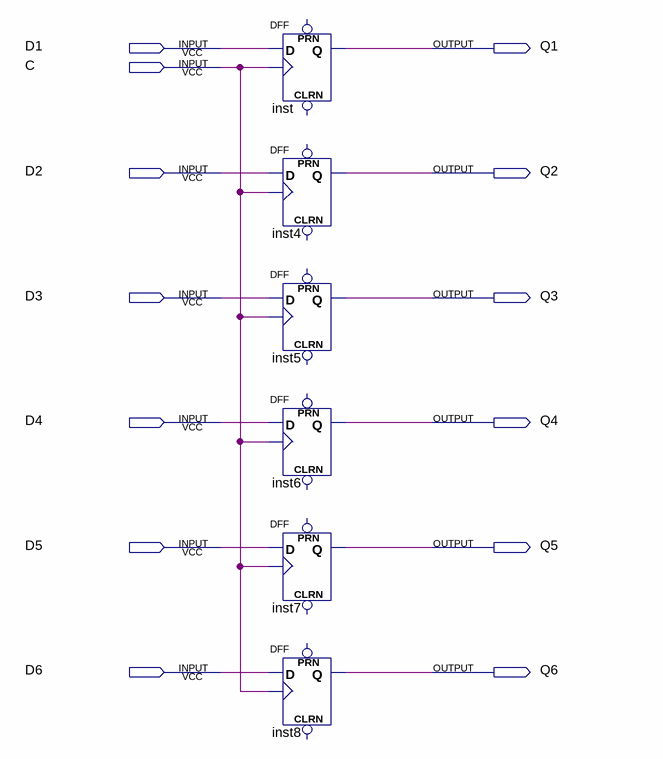
[diagram p0: schematic sheet]
// Quartus schematic register.bdf as structural Verilog: 6 symbols, 13 pins
module register (
  input  D1,
  input  C,
  input  D2,
  input  D3,
  input  D4,
  input  D5,
  input  D6,
  output Q1,
  output Q2,
  output Q3,
  output Q4,
  output Q5,
  output Q6
);

  DFF inst (.CLK(C), .D(D1), .Q(Q1));  // open: CLRN, PRN
  DFF inst4 (.CLK(C), .D(D2), .Q(Q2));  // open: CLRN, PRN
  DFF inst5 (.CLK(C), .D(D3), .Q(Q3));  // open: CLRN, PRN
  DFF inst6 (.CLK(C), .D(D4), .Q(Q4));  // open: CLRN, PRN
  DFF inst7 (.CLK(C), .D(D5), .Q(Q5));  // open: CLRN, PRN
  DFF inst8 (.CLK(C), .D(D6), .Q(Q6));  // open: CLRN, PRN
endmodule
